# EAGLE design Driver mosfet v1 4 (EAGLE 9.6.2)
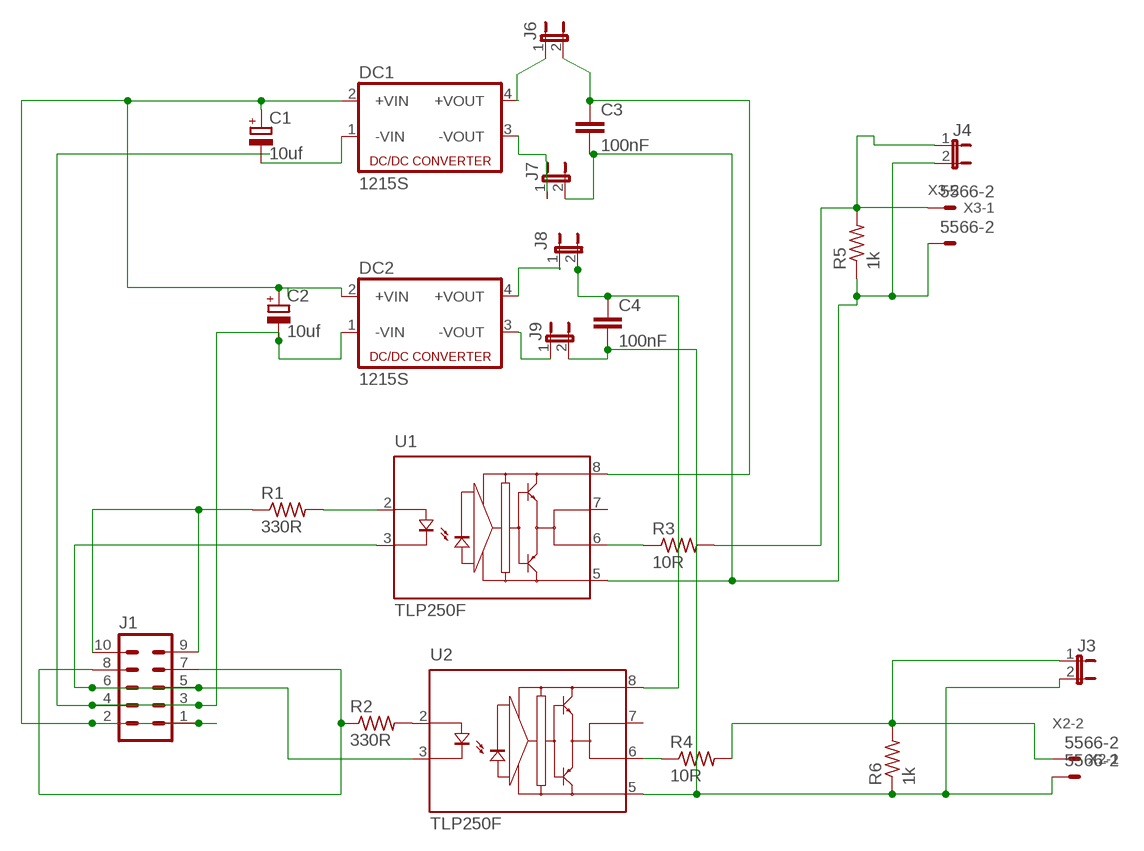
[diagram p0: schematic, sheet 1]

## Parts
C1  10uf  CPOL-EUE2.5-6  [E2,5-6]
C2  10uf  CPOL-EUE2.5-6  [E2,5-6]
C3  100nF  C5/3.5  [C5B3.5]
C4  100nF  C5/3.5  [C5B3.5]
DC1  1215S  VA-2409S1.5  [4SIL]
DC2  1215S  VA-2409S1.5  [4SIL]
J1  MA05-2  [MA05-2]
J3  JP1E  [JP1]
J4  JP1E  [JP1]
J6  JP1E  [JP1]
J7  JP1E  [JP1]
J8  JP1E  [JP1]
J9  JP1E  [JP1]
R1  330R  R-US_0309/12  [0309/12]
R2  330R  R-US_0309/12  [0309/12]
R3  10R  R-US_0309/12  [0309/12]
R4  10R  R-US_0309/12  [0309/12]
R5  1k  R-US_0309/12  [0309/12]
R6  1k  R-US_0309/12  [0309/12]
U1  TLP250F  [DIL08]
U2  TLP250F  [DIL08]
X2  5566-2  [5566-2]
X3  5566-2  [5566-2]

## Nets
N$1: R2.2 U2.2(A)
N$2: C4.1 J8.2 U2.8(VCC)
N$3: C1.+ C2.+ DC1.2(+VIN) DC2.2(+VIN) J1.1 J1.2
N$4: R4.1 U2.6(VO)
N$5: C3.1 J6.2 U1.8(VCC)
N$6: DC1.4(+VOUT) J6.1
N$7: R3.1 U1.6(VO)
N$8: R1.2 U1.2(A)
N$9: J1.9 J1.10 R1.1
N$10: DC2.4(+VOUT) J8.1
N$12: C3.2 J4.2 J7.2 R5.1 U1.5(GND) X3.2
N$13: J1.5 J1.6 U1.3(K) U2.3(K)
N$16: J4.1 R3.2 R5.2 X3.1
N$17: J3.1 R4.2 R6.2 X2.1
N$19: C4.2 J3.2 J9.2 R6.1 U2.5(GND) X2.2
N$21: J1.7 J1.8 R2.1
N$22: C1.- C2.- DC1.1(-VIN) DC2.1(-VIN) J1.3 J1.4
N$29: DC1.3(-VOUT) J7.1
N$34: DC2.3(-VOUT) J9.1
Unconnected: U1.7(VO') U2.7(VO')

## Library data of the parts
C1 C2 = rcl:CPOL-EU: POLARIZED CAPACITOR, European symbol
C3 C4 = capacitor-wima:C: CAPACITOR naming: grid - package width
DC1 DC2 = dc-dc-converter:VA-*?: DC DC Converter Single Output, 1 Watt Motien Technology Co.,Ltd. Source: Data sheet <http://www.motien.com.tw/data_sheet/VA-1%28H%29.pdf>; OC_FARNELL: unknown; OC_NEWARK: unknown
J1 = con-lstb:MA05-2: PIN HEADER; OC_FARNELL: unknown; OC_NEWARK: unknown
J3 J4 J6-J9 = jumper:JP1E: JUMPER
R1-R6 = rcl@1:R-US_: RESISTOR, American symbol; SPICEPREFIX: R
U1 U2 = optocoupler-3-jcn (1):TLP250F: Toshiba Transistor Inverter Inverter For Air Conditionor IGBT Gate Drive Power MOS FET Gate Drive
X2 X3 = con-molex:5566-2: Mini FIT connector 2 pol Source: http://www.molex.com; MF: MOLEX; OC_FARNELL: 1822072; OC_NEWARK: unknown

## Board
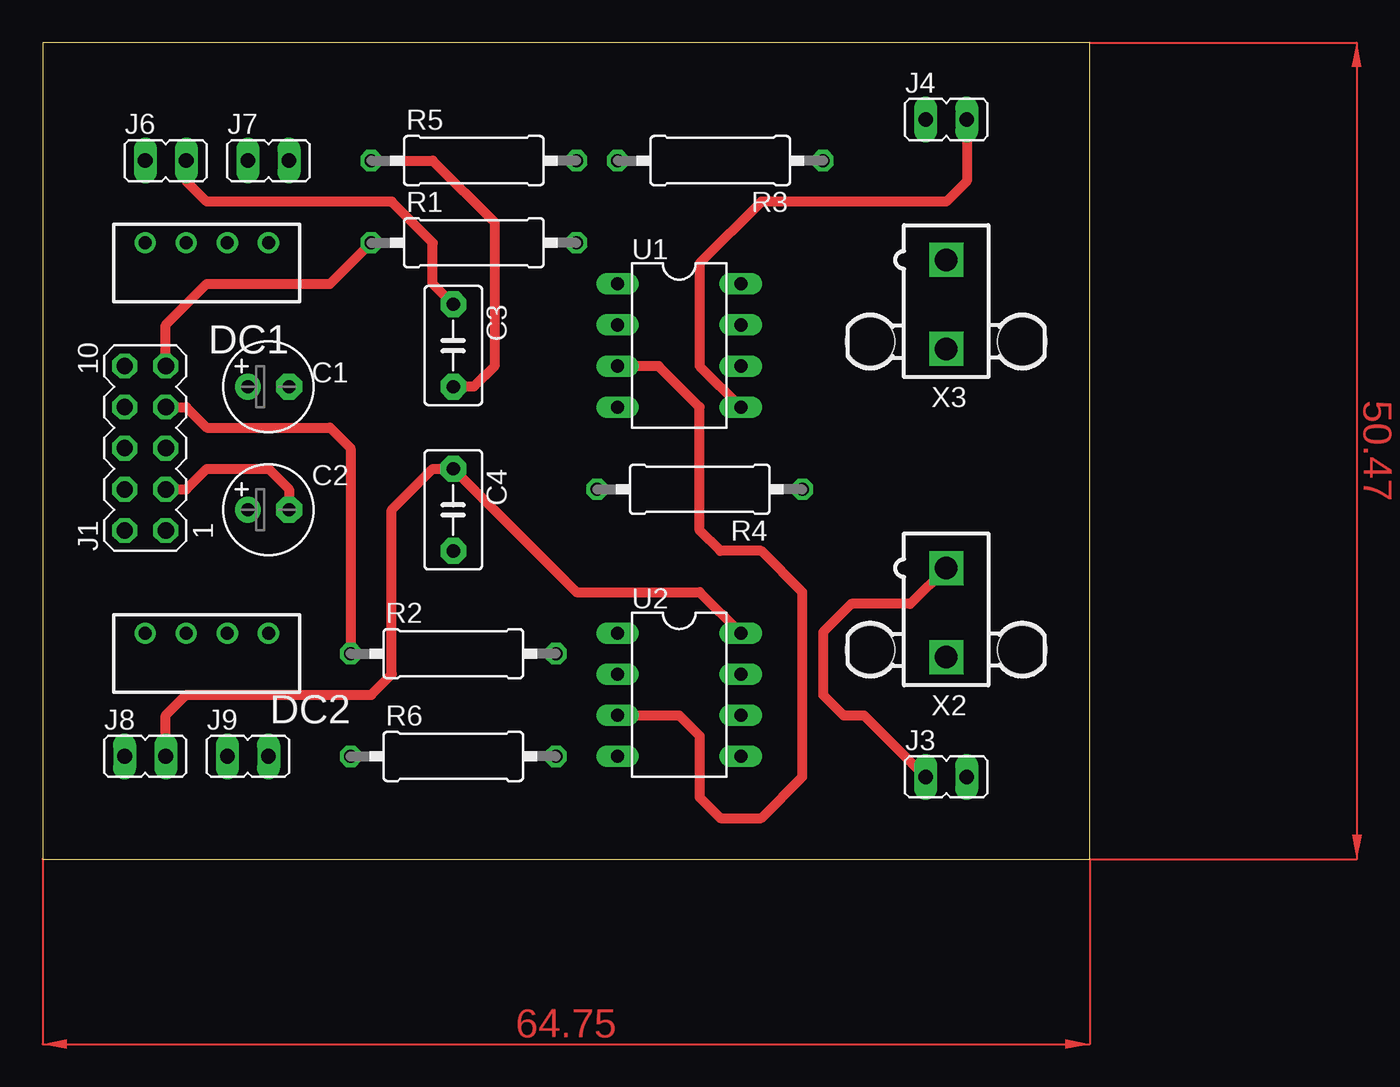
[diagram p1: board, top side]
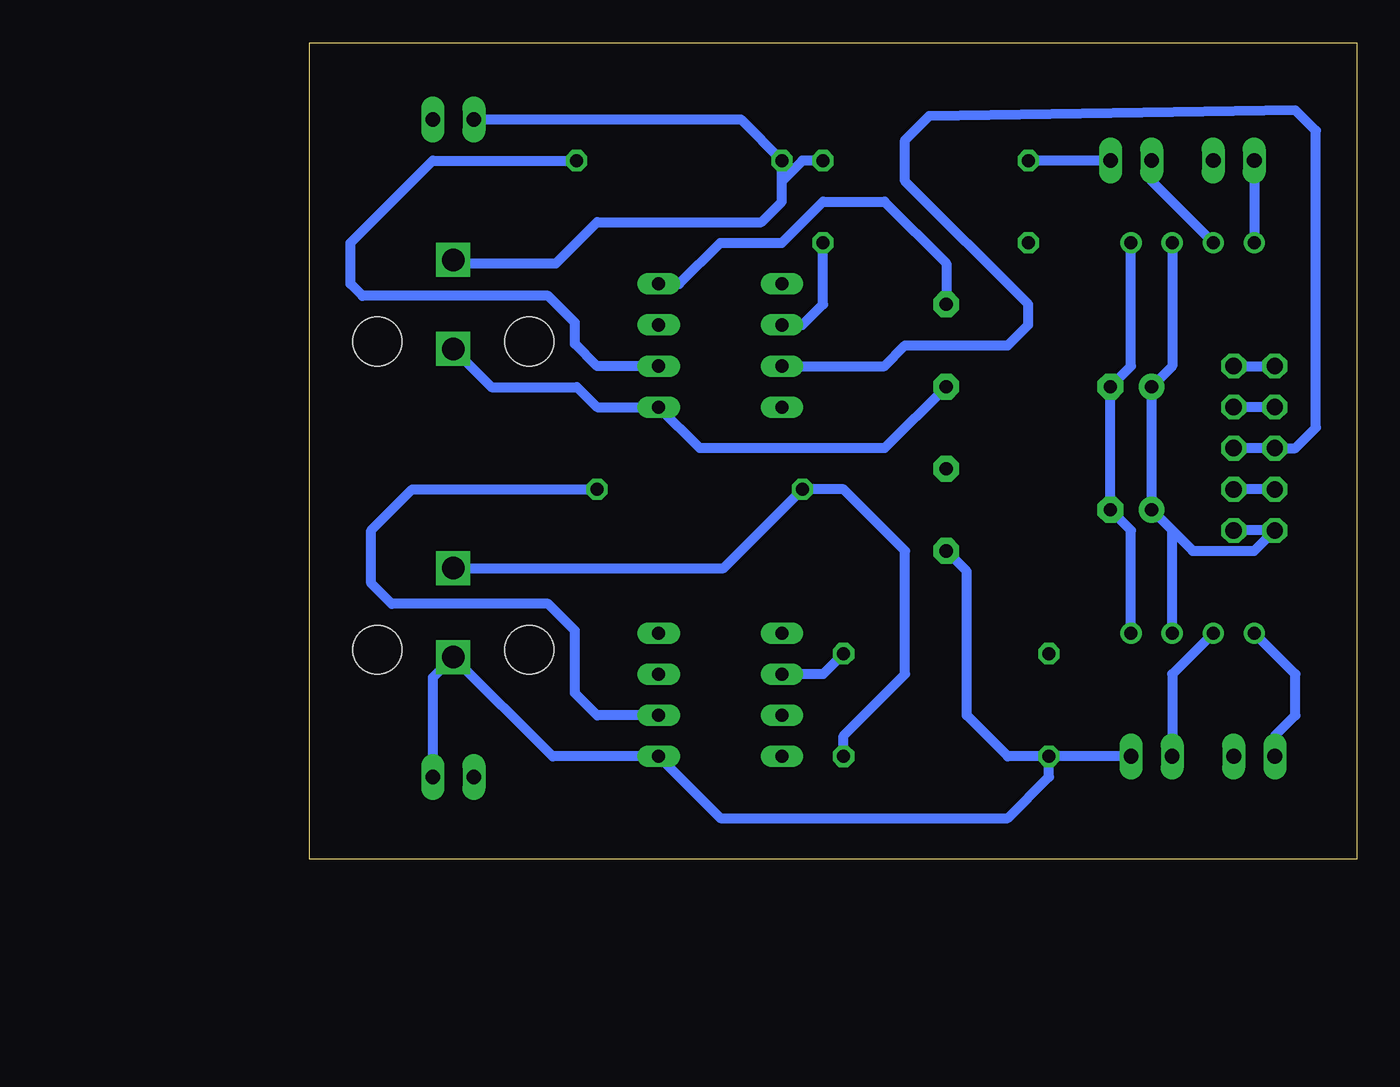
[diagram p2: board, bottom side, seen from below]

Size 64.75 x 50.47 mm. Coordinates in mm from the lower left corner, seen from the top.
Outline: 0,0 64.75,0 64.75,50.47 0,50.47 0,0
Copper layers (1*16): Top 0.035mm / dielectric 1.5mm / Bottom 0.035mm
Design rules "default": minimum track width 6mil, minimum drill 0.35mm, track to track 6mil, track to pad 6mil, pad to pad 6mil, via to via 6mil, smd to smd 6mil, copper to edge 40mil, drill to drill 6mil, minimum pad ring 10mil, minimum via ring 8mil, stop-mask expansion 4mil, vias tented up to drill 0mil, thermal gap 10mil

### Footprints (pad centres in the part's own frame; a part is rotated, then mirrored left to right if it is on the bottom)
E2,5-6 = drill 0.813 pad 1.6: + -1.27,0 | drill 0.813 pad 1.6 octagon: - 1.27,0
C5B3.5 = drill 0.813 pad 1.6 octagon: 1 -2.54,0; 2 2.54,0
4SIL = drill 0.8: 1 -3.81,0; 2 -1.27,0; 3 1.27,0; 4 3.81,0
MA05-2 = drill 1.016 octagon: 1 -5.08,-1.27; 2 -5.08,1.27; 3 -2.54,-1.27; 4 -2.54,1.27; 5 0,-1.27; 6 0,1.27; 7 2.54,-1.27; 8 2.54,1.27; 9 5.08,-1.27; 10 5.08,1.27
JP1 = drill 0.914 long: 1 0,-1.27; 2 0,1.27
0309/12 = drill 0.813 octagon: 1 -6.35,0; 2 6.35,0
DIL08 = drill 0.813 long: 1 -3.81,-3.81; 2 -1.27,-3.81; 3 1.27,-3.81; 4 3.81,-3.81; 5 3.81,3.81; 6 1.27,3.81; 7 -1.27,3.81; 8 -3.81,3.81
5566-2 = drill 1.4 square: 1 0,-2.75; 2 0,2.75 | hole 3: 4.7,2.29; -4.7,2.29

### Placement (x,y rotation side)
C1  13.97,29.21 0 top
C2  13.97,21.59 0 top
C3  25.4,31.75 270 top
C4  25.4,21.59 270 top
DC1  10.16,38.1 180 top
DC2  10.16,13.97 180 top
J1  6.35,25.4 90 top
J3  55.88,5.08 270 top
J4  55.88,45.72 270 top
J6  7.62,43.18 270 top
J7  13.97,43.18 270 top
J8  6.35,6.35 270 top
J9  12.7,6.35 270 top
R1  26.67,38.1 0 top
R2  25.4,12.7 0 top
R3  41.91,43.18 180 top
R4  40.64,22.86 180 top
R5  26.67,43.18 0 top
R6  25.4,6.35 0 top
U1  39.37,31.75 270 top
U2  39.37,10.16 270 top
X2  55.88,15.24 180 top
X3  55.88,34.29 180 top

### Tracks (layer width: path | path; a pad name or v marks a point on that pad's centre or on a via)
N$1
  Bottom 0.61: R2.2 33.02,11.43 U2.2
N$2
  Top 0.61: J8.2 7.62,8.89 8.89,10.16 20.32,10.16 21.59,11.43 21.59,21.59 24.13,24.13 C4.1 33.02,16.51 40.64,16.51 U2.8
N$3
  Bottom 0.61: DC2.2 11.43,20.32 C2.+ | C2.+ 10.16,19.05 6.35,19.05 J1.2 J1.1 | DC1.2 11.43,30.48 C1.+ C2.+
N$4
  Bottom 0.61: R4.1 58.42,22.86 60.96,20.32 60.96,17.04 59.69,15.77 50.01,15.77 48.36,14.12 48.36,10.26 46.99,8.89 U2.6
N$5
  Top 0.61: C3.1 24.13,35.56 24.13,38.1 21.59,40.64 10.16,40.64 8.89,41.91 J6.2
  Bottom 0.61: U1.8 41.91,35.56 39.37,38.1 35.56,38.1 33.02,40.64 29.21,40.64 25.4,36.83 C3.1
N$6
  Bottom 0.61: J6.1 DC1.4
N$7
  Bottom 0.61: U1.6 46.99,30.48 48.36,31.85 48.36,33.17 50.01,34.82 61.49,34.82 62.23,35.56 62.23,38.1 57.15,43.18 R3.1
N$8
  Bottom 0.61: U1.2 34.29,33.02 33.02,34.29 R1.2
N$9
  Top 0.61: J1.9 7.62,33.02 10.16,35.56 17.78,35.56 R1.1
  Bottom 0.61: J1.9 J1.10
N$10
  Bottom 0.61: J8.1 5.08,7.62 3.81,8.89 3.81,11.43 DC2.4
N$12
  Top 0.61: R5.1 24.13,43.18 27.94,39.37 27.94,30.48 26.67,29.21 C3.2 | J4.2 57.15,41.91 55.88,40.64 44.45,40.64 40.64,36.83 40.64,30.48 U1.5
  Bottom 0.61: J7.2 R5.1 | C3.2 29.21,25.4 40.64,25.4 U1.5 46.99,27.94 48.23,29.18 53.52,29.18 X3.2
N$13
  Top 0.61: U2.3 39.37,8.89 40.64,7.62 40.64,3.81 41.91,2.54 44.45,2.54 46.99,5.08 46.99,16.51 44.45,19.05 41.91,19.05 40.64,20.32 40.64,27.94 38.1,30.48 U1.3
  Bottom 0.61: J1.5 J1.6 3.81,25.4 2.54,26.67 2.54,45.03 3.8,46.29 26.46,45.93 27.94,44.45 27.94,41.91 20.32,34.29 20.32,33.02 21.59,31.75 27.94,31.75 29.21,30.48 U1.3
N$16
  Bottom 0.61: X3.1 55.67,36.83 49.53,36.83 46.99,39.37 36.83,39.37 35.56,40.64 35.56,41.91 | 35.56,41.91 R3.2 38.1,45.72 J4.1 | R5.2 34.29,43.18 35.56,41.91
N$17
  Top 0.61: J3.1 50.8,8.89 49.53,8.89 48.26,10.16 48.26,14.02 50.01,15.77 53.66,15.77 X2.1
  Bottom 0.61: X2.1 39.16,17.99 R4.2 31.75,22.86 27.94,19.05 27.94,11.43 31.75,7.62 R6.2
N$19
  Bottom 0.61: J9.2 R6.1 | R6.1 21.59,6.35 24.13,8.89 24.13,17.78 C4.2 | R6.1 19.05,5.08 21.59,2.54 39.37,2.54 U2.5 49.74,6.35 X2.2 57.15,11.22 J3.2
N$21
  Top 0.61: J1.7 8.89,27.94 10.16,26.67 17.78,26.67 19.05,25.4 R2.1
  Bottom 0.61: J1.8 J1.7
N$22
  Top 0.61: J1.3 8.89,22.86 10.16,24.13 13.97,24.13 15.24,22.86 C2.-
  Bottom 0.61: DC2.1 13.97,20.32 C2.- C1.- 13.97,30.48 DC1.1 | J1.4 J1.3
N$29
  Bottom 0.61: DC1.3 12.7,41.91 J7.1
N$34
  Bottom 0.61: DC2.3 11.43,11.43 J9.1
(copper drawn outside any net)
  shapes: Top area x2

### Text on the board
Reference: G | G